# EAGLE design usb_program_charge_dongle (EAGLE 6.6.0)

## Sheet 1 of 4
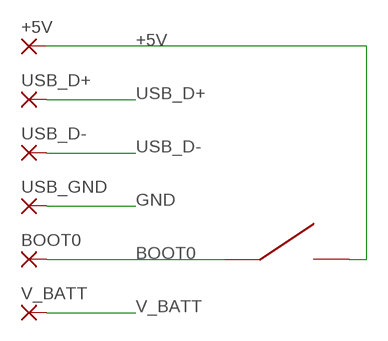
[diagram p0: schematic, sheet 1]

### Parts
+5V  SMD2  [SMD1,27-2,54]
BOOT0  SMD2  [SMD1,27-2,54]
SW2  B3U  [B3U]
USB_D+  SMD2  [SMD1,27-2,54]
USB_D-  SMD2  [SMD1,27-2,54]
USB_GND  SMD2  [SMD1,27-2,54]
V_BATT  SMD2  [SMD1,27-2,54]

### Nets
+5V: +5V.1(P) SW2.P$2 ; also sheet 2,4
BOOT0: BOOT0.1(P) SW2.P$1
GND: USB_GND.1(P) ; also sheet 2,3,4
USB_D+: USB_D+.1(P) ; also sheet 3
USB_D-: USB_D-.1(P) ; also sheet 3
V_BATT: V_BATT.1(P) ; also sheet 4

## Sheet 2 of 4
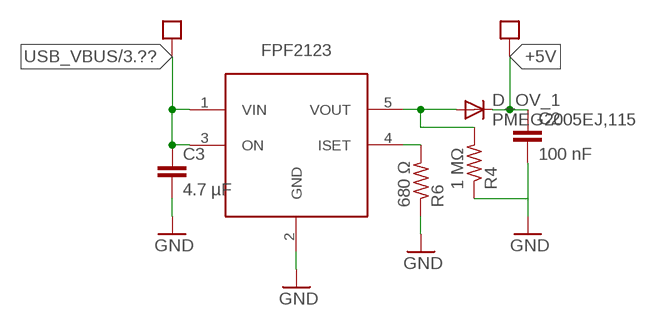
[diagram p1: schematic, sheet 2]

### Parts
C2  100 nF  C-EUC0603  [C0603]
C3  4.7 µF  C-EUC0603  [C0603]
D_OV_1  PMEG2005EJ,115  DIODE-SOD323-W  [SOD323-W]
FPF2123  FPF2123  [SOT23-5L]
R4  1 MΩ  R-US_R0603  [R0603]
R6  680 Ω  R-US_R0603  [R0603]

### Nets
+5V: C2.1 D_OV_1.C ; supply symbol labelled BLOCK_REQUIREMENT ; also sheet 1,4
GND: C2.2 C3.2 FPF2123.2(GND) R4.1 R6.1 ; also sheet 1,3,4
LOAD_ISET_1: FPF2123.4(ISET) R6.2
N$17: D_OV_1.A FPF2123.5(VOUT) R4.2
USB_VBUS: C3.1 FPF2123.1(VIN) FPF2123.3(ON) ; supply symbol labelled BLOCK_REQUIREMENT ; also sheet 3

## Sheet 3 of 4
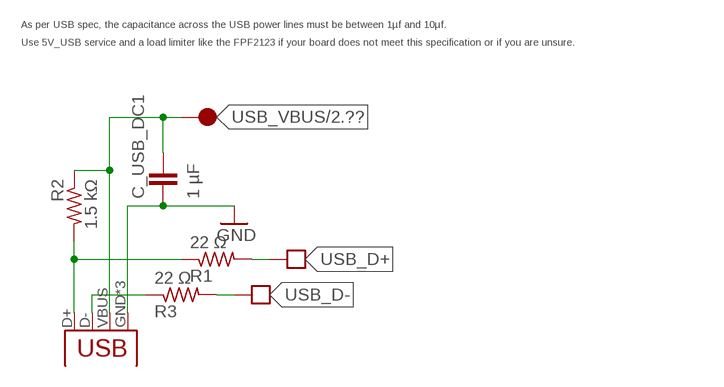
[diagram p2: schematic, sheet 3]

### Parts
C_USB_DC1  1 µF  C-EUC0603  [C0603]
R1  22 Ω  R-US_R0603  [R0603]
R2  1.5 kΩ  R-US_R0603  [R0603]
R3  22 Ω  R-US_R0603  [R0603]
X1  USB-MICROB  [USB-MICROB]

### Nets
D+_IN_1: R1.1 R2.2 X1.D+
D-_IN_1: R3.1 X1.D-
GND: C_USB_DC1.2 X1.GND X1.MT1(GND) X1.MT2(GND) ; also sheet 1,2,4
USB_D+: R1.2 ; supply symbol labelled BLOCK_REQUIREMENT ; also sheet 1
USB_D-: R3.2 ; supply symbol labelled BLOCK_REQUIREMENT ; also sheet 1
USB_VBUS: C_USB_DC1.1 R2.1 X1.VBUS ; supply symbol labelled BLOCK_CONNECTOR ; also sheet 2

### Notes on the sheet
- As per USB spec, the capacitance across the USB power lines must be between 1µf and 10µf.
- Use 5V_USB service and a load limiter like the FPF2123 if your board does not meet this specification or if you are unsure.

## Sheet 4 of 4
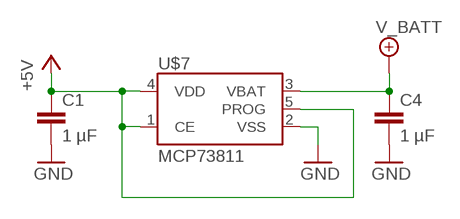
[diagram p3: schematic, sheet 4]

### Parts
C1  1 µF  C-EUC0603  [C0603]
C4  1 µF  C-EUC0603  [C0603]
U$7  MCP73811  [SOT23-5]

### Nets
+5V: C1.1 U$7.1(CE) U$7.4(VDD) U$7.5(PROG) ; also sheet 1,2
GND: C1.2 C4.2 U$7.2(VSS) ; also sheet 1,2,3
V_BATT: C4.1 U$7.3(VBAT) ; also sheet 1

## Library data of the parts
+5V BOOT0 USB_D+ USB_D- USB_GND V_BATT = wirepad:SMD2: SMD PAD
C1-C4 C_USB_DC1 = rcl:C-EU: CAPACITOR, European symbol
D_OV_1 = diode:DIODE-: DIODE
FPF2123 = neels:FPF2123
R1-R4 R6 = resistor:R-US_: RESISTOR, American symbol
SW2 = zz-upenn:B3U
U$7 = block_parts:MCP73811: The MCP73811 is a Simple, Miniature Single-Cell, Fully Integrated Li-Ion / Li-Polymer Charge Management Controller from Microchip. http://ww1.microchip.com/downloads/en/DeviceDoc/22036b.pdf
X1 = SparkFun:USB: USB Connectors USB-B-PTH is fully proven SKU : PRT-00139 USB-miniB is fully proven SKU : PRT-00587 USB-A-PCB is untested. USB-A-H is throughly reviewed, but untested. Spark Fun Electronics SKU : PRT-00437 USB-B-SMT is throughly reviewed, but untested. Needs silkscreen touching up. USB-A-S has not been used/tested USB-MB-H has not been used/tested

## Board
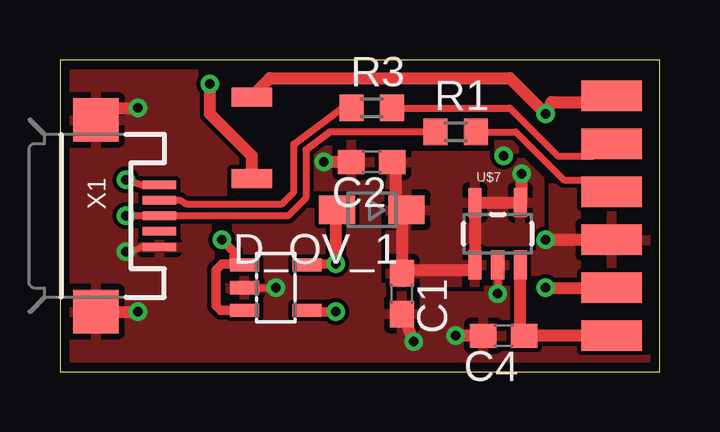
[diagram p4: board, top side]
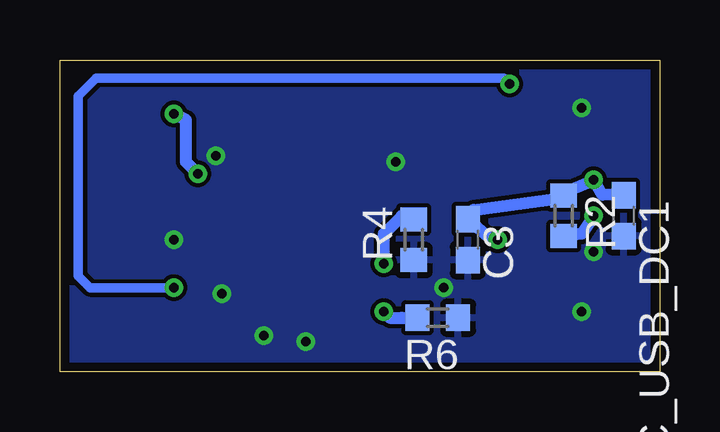
[diagram p5: board, bottom side, seen from below]

Size 25 x 13 mm. Coordinates in mm from the lower left corner, seen from the top.
Outline: 0,0 25,0 25,13 0,13 0,0
Copper layers (1*16): Top 0.0356mm / dielectric 1.5011mm / Bottom 0.0356mm
Design rules "LaenPCBOrder *": minimum track width 6mil, minimum drill 13mil, track to track 7mil, track to pad 8mil, pad to pad 8mil, via to via 8mil, smd to smd 6mil, copper to edge 15mil, drill to drill 6mil, minimum pad ring 7mil, minimum via ring 7mil, stop-mask expansion 4mil, vias tented up to drill 0mil, thermal gap 10mil

### Footprints (pad centres in the part's own frame; a part is rotated, then mirrored left to right if it is on the bottom)
SMD1,27-2,54 = smd 1.27 x 2.54: 1 0,0
C0603 = smd 1.1 x 1: 1 -0.85,0; 2 0.85,0
SOD323-W = smd 1.5 x 1.2: A 1.45,0; C -1.45,0
SOT23-5L = smd 0.55 x 1.2: 1 -0.95,-1.3; 2 0,-1.3; 3 0.95,-1.3; 4 0.95,1.3; 5 -0.95,1.3
R0603 = smd 1 x 1.1: 1 -0.85,0; 2 0.85,0
B3U = smd 0.8 x 1.7: P$1 -1.7,0; P$2 1.7,0
SOT23-5 = smd 0.55 x 1.2: 1 -0.95,-1.3; 2 0,-1.3; 3 0.95,-1.3; 4 0.95,1.3; 5 -0.95,1.3
USB-MICROB = smd 0.35 x 1.4: D+ 0,2.65; D- -0.65,2.65; GND 1.3,2.65; ID 0.65,2.65; VBUS -1.3,2.65 | smd 1.8 x 1.9: MT1 -4,0; MT2 4,0

### Placement (x,y rotation side)
+5V  23,11.5 90 top
BOOT0  23,3.5 90 top
C1  14.25,3.25 270 top
C2  13,8.75 180 top
C3  8,5.5 270 bottom
C4  18.5,1.5 180 top
C_USB_DC1  1.5,6.5 270 bottom
D_OV_1  13,6.75 180 top
FPF2123  9,3.5 270 top
R1  16.5,10 0 top
R2  4,6.5 270 bottom
R3  13,11 0 top
R4  10.25,5.5 90 bottom
R6  9.25,2.25 180 bottom
SW2  8,9.75 90 top
U$7  18.25,5.75 0 top
USB_D+  23,7.5 90 top
USB_D-  23,9.5 90 top
USB_GND  23,5.5 90 top
V_BATT  23,1.5 90 top
X1  1.5,6.5 270 top

### Tracks (layer width: path | path; a pad name or v marks a point on that pad's centre or on a via)
+5V  (via drill 0.4)
  Top 0.3: 14.25,4.25 14.5,4.25 C1.1 | U$7.4 19.25,7.1 | 22.25,11.25 +5V.1
  Top 0.406: 17.3,4.25 U$7.1
  Top 0.5: C2.1 14,8.75 14,7.2 D_OV_1.C 14.25,6.75 14.25,4.25 | U$7.4 U$7.5 U$7.1 | 19.25,7.1 v19.25,8.25 | 22.25,11.25 20.5,11.25 v20.25,10.75 18.75,12.25 8.75,12.25 8,11.5 SW2.P$2 | 14.5,4.25 17.3,4.25
  Bottom 0.5: v19.25,8.25 19.75,8.75 19.75,10.5 v20.25,10.75
  pour Top: 13.75,9 13.75,3.75 20,3.75 20,8 19,9
BOOT0  (via drill 0.4)
  Top 0.5: SW2.P$1 8,9 6.25,10.75 v6.25,12 | v20.25,3.5 BOOT0.1
  Bottom 0.4: v6.25,12 6.5,12.25 23.5,12.25 24.25,11.5 24.25,4 23.75,3.5 v20.25,3.5
D+_IN_1  (via drill 0.4)
  Top 0.3: v2.75,6.5 X1.D+ 9.5,6.5 10.25,7.25 10.25,9.25 11.25,10 R1.1
  Bottom 0.5: v2.75,6.5 3.25,5.75 R2.2
D-_IN_1
  Top 0.3: R3.1 11.75,11 9.75,9.5 9.75,7.5 9.25,7 5.25,7 5,7.15 X1.D-
GND  (via drill 0.4)
  Top 0.3: X1.GND 3.5,5.25 3,5 v2.75,5 | FPF2123.2 v9,3.5 | U$7.2 v18.25,3.25
  Top 0.5: X1.MT2 v3.25,2.5 | X1.MT1 1.5,11 v3.25,11 | C2.2 v11,8.75 | C1.2 v14.75,1.25 | C4.2 v16.5,1.5 | USB_GND.1 v20.25,5.5
  other vias: 18.5,9
  pour Bottom: 0,13 25,13 25,0 0,0
  pour Top (rank 2): 0,13 25,13 25,0 0,0
LOAD_ISET_1  (via drill 0.4)
  Top 0.3: FPF2123.4 10.5,2.5
  Top 0.4: 10.5,2.5 v11.5,2.5
  Bottom 0.5: v11.5,2.5 11.25,2.25 10.75,2.25 R6.2
N$17  (via drill 0.4)
  Top 0.3: 11.5,6.75 11.45,6.7 D_OV_1.A
  Top 0.4: FPF2123.5 10.75,4.5 v11.5,4.5
  Top 0.5: v11.5,4.5 11.5,6.75
  Bottom 0.5: v11.5,4.5 11.5,5.75 10.75,6.5 10.25,6.5 R4.2
USB_D+
  Top 0.3: R1.2 19,10 21,8 22.5,8 USB_D+.1
USB_D-
  Top 0.3: R3.2 18.75,11 20.75,9 22.25,9 USB_D-.1
USB_VBUS  (via drill 0.4)
  Top 0.3: X1.VBUS 3.5,7.75 v2.75,8 | FPF2123.3 7.75,2.5 | FPF2123.1 7.25,4.5
  Top 0.4: v6.75,5.5 7.25,5 7.25,4.5 6.75,4.5 6.5,4.25 6.5,2.75 6.7,2.55 FPF2123.3
  Bottom 0.406: R2.1 4.08,7.42
  Bottom 0.5: C_USB_DC1.1 2.38,7.38 v2.75,8 4.08,7.42 | R2.1 4.1,7.25 7.75,6.75 C3.1 7,5.5 v6.75,5.5
V_BATT
  Top 0.5: V_BATT.1 C4.1 19.2,1.65 U$7.3

### Text on the board
tValues: SWITCH
bDocu: Paulos | D- | D+ | GND | +Prog | Charge | BATT | 06-14